# EasyEDA schematic SCH_robot_arm_2022-02-01.json
TITLE: Robot arm; REV: 1.0; Date: 2022-02-01; Sheet: 1/1; Drawn By: 07et842; Company: -
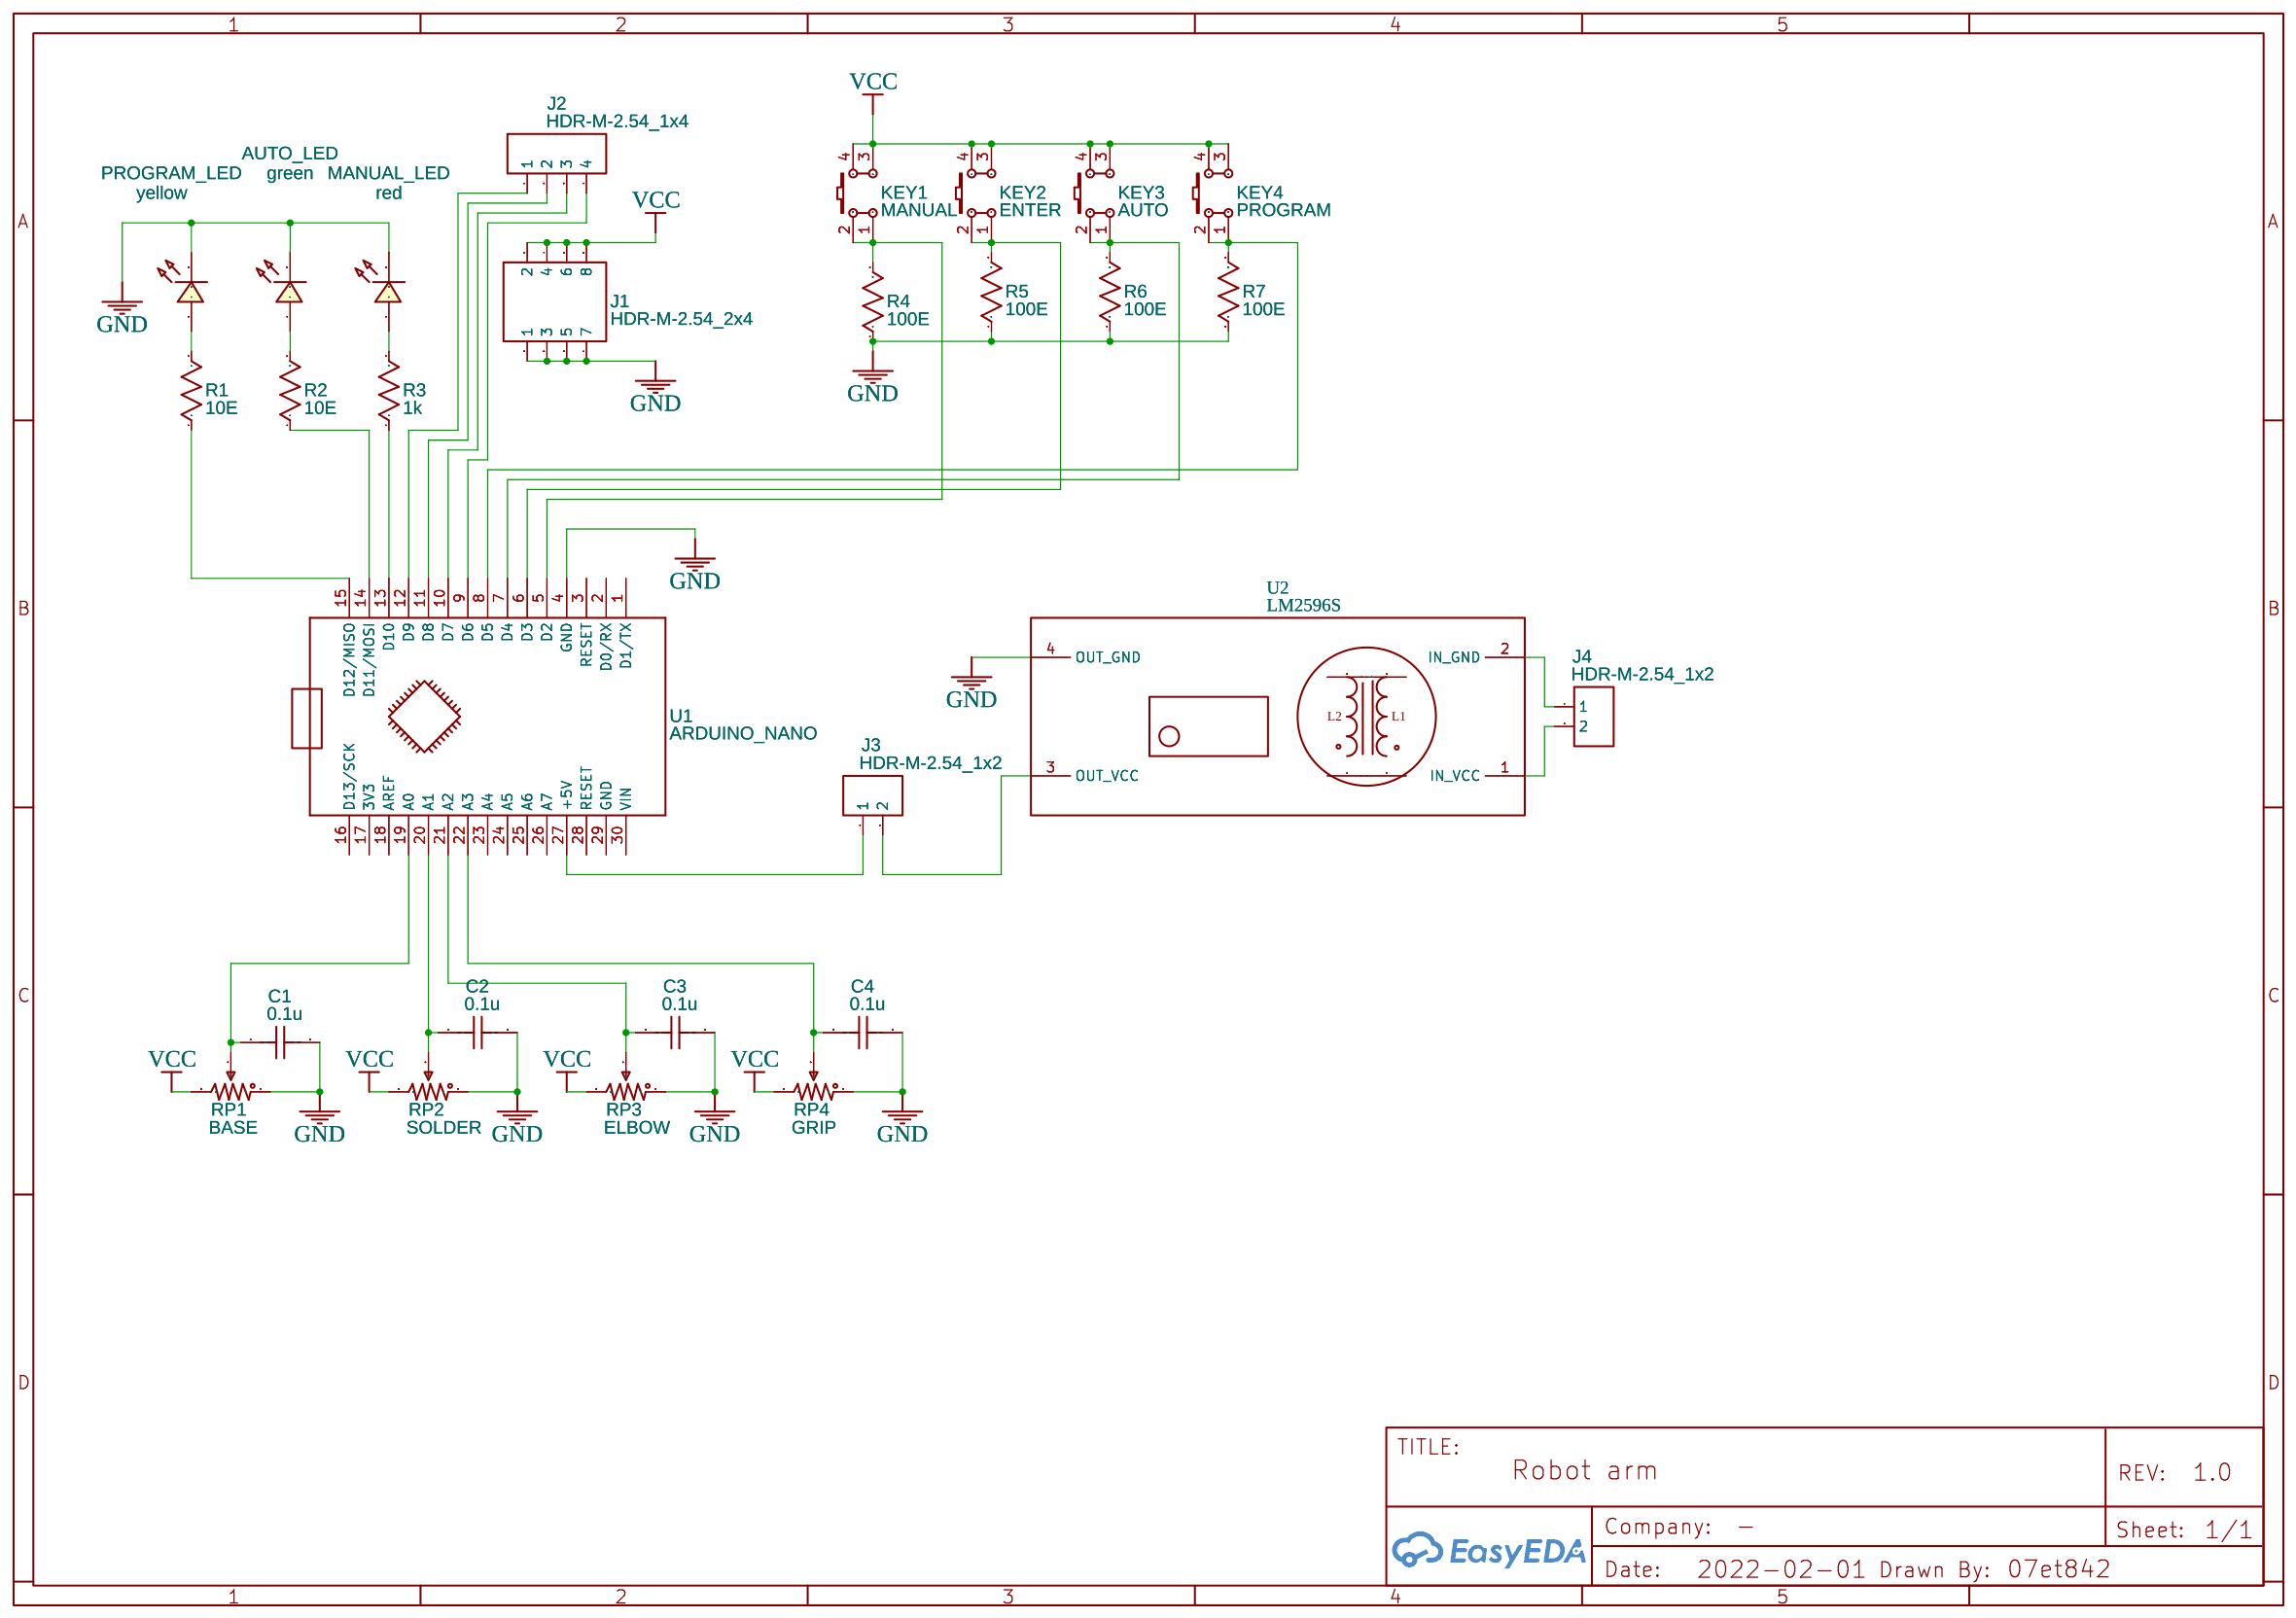
[diagram p0: schematic sheet]

## Parts
AUTO_LED  green  [LED0603_RED]
C1  0.1u  [C0603]
C2  0.1u  [C0603]
C3  0.1u  [C0603]
C4  0.1u  [C0603]
J1  HDR-M-2.54_2x4  [HDR-M-2.54_2X4]
J2  HDR-M-2.54_1x4  [HDR-M-2.54_1X4]
J3  HDR-M-2.54_1x2  [HDR-M-2.54_1X2]
J4  HDR-M-2.54_1x2  [HDR-M-2.54_1X2]
KEY1  MANUAL  [KEY-TH_4P-L6.0-W6.0-P4.50-LS6.5]
KEY2  ENTER  [KEY-TH_4P-L6.0-W6.0-P4.50-LS6.5]
KEY3  AUTO  [KEY-TH_4P-L6.0-W6.0-P4.50-LS6.5]
KEY4  PROGRAM  [KEY-TH_4P-L6.0-W6.0-P4.50-LS6.5]
MANUAL_LED  red  [LED0603_RED]
PROGRAM_LED  yellow  [LED0603_RED]
R1  10E  [R0603]
R2  10E  [R0603]
R3  1k  [R0603]
R4  100E  [R0603]
R5  100E  [R0603]
R6  100E  [R0603]
R7  100E  [R0603]
RP1  BASE  [RES-ADJ-TH_3386P]
RP2  SOLDER  [RES-ADJ-TH_3386P]
RP3  ELBOW  [RES-ADJ-TH_3386P]
RP4  GRIP  [RES-ADJ-TH_3386P]
U1  ARDUINO_NANO  [ARDUINO_NANO]
U2  LM2596S

## Library data of the parts
AUTO_LED MANUAL_LED PROGRAM_LED = LED-0603_R: Manufacturer: EVERLIGHT(台湾亿光); Manufacturer Part: 19-217/R6C-AL1M2VY/3T; Supplier Part: C72044; Supplier: LCSC; Contributor: LCEDA_01
C1-C4 = C_0603_US: Contributor: LCEDA_Lib
J1 = HDR-M-2.54_2x4: Supplier Part: C58363; Supplier: LCSC; Contributor: LCEDA_Lib
J2 = HDR-M-2.54_1x4: Supplier Part: C124378; Supplier: LCSC; Contributor: LCEDA_Lib
J3 J4 = HDR-M-2.54_1x2: Supplier Part: C124375; Supplier: LCSC; Contributor: LCEDA_Lib
KEY1-KEY4 = K4-6×6_TH: Supplier: LCSC; Supplier Part: C136684; Manufacturer: 韩国韩荣; Manufacturer Part: K2-1102DP-E4SW-04; Contributor: LCEDA_Lib
R1-R7 = R_0603_US: Contributor: LCEDA_Lib
RP1-RP4 = R_3386P_US: Supplier: LCSC; Contributor: LCEDA_Lib; value(Ω): 10K
U1 = -: sourceId: KGSeAWhDB; Manufacturer Part: ?

## Nets
GND: AUTO_LED.2 C1.2 C2.2 C3.2 C4.2 J1.1 J1.3 J1.5 J1.7 MANUAL_LED.2 PROGRAM_LED.2 R4.1 R5.1 R6.1 R7.1 RP1.1 RP2.1 RP3.1 RP4.1 U1.4(GND) U2.4(OUT_GND)
VCC: J1.2 J1.4 J1.6 J1.8 KEY1.3 KEY1.4 KEY2.3 KEY2.4 KEY3.3 KEY3.4 KEY4.3 KEY4.4 RP1.3 RP2.3 RP3.3 RP4.3
Net-(AUTO_LED-1): AUTO_LED.1 R2.2
Net-(C1-1): C1.1 RP1.2 U1.19(A0)
Net-(C2-1): C2.1 RP2.2 U1.20(A1)
Net-(C3-1): C3.1 RP3.2 U1.21(A2)
Net-(C4-1): C4.1 RP4.2 U1.22(A3)
Net-(J2-1): J2.1 U1.12(D9)
Net-(J2-2): J2.2 U1.11(D8)
Net-(J2-3): J2.3 U1.10(D7)
Net-(J2-4): J2.4 U1.9(D6)
Net-(J3-1): J3.1 U1.27(+5V)
Net-(J3-2): J3.2 U2.3(OUT_VCC)
Net-(J4-1): J4.1 U2.2(2 )
Net-(J4-2): J4.2 U2.1(1 )
Net-(KEY1-1): KEY1.1 KEY1.2 R4.2 U1.5(D2)
Net-(KEY2-1): KEY2.1 KEY2.2 R5.2 U1.6(D3)
Net-(KEY3-1): KEY3.1 KEY3.2 R6.2 U1.7(D4)
Net-(KEY4-1): KEY4.1 KEY4.2 R7.2 U1.8(D5)
Net-(MANUAL_LED-1): MANUAL_LED.1 R3.2
Net-(PROGRAM_LED-1): PROGRAM_LED.1 R1.2
Net-(R1-1): R1.1 U1.15(D12/MISO)
Net-(R2-1): R2.1 U1.14(D11/MOSI)
Net-(R3-1): R3.1 U1.13(D10)

Not connected (* = marked no-connect by the designer): U1 1(D1/TX) 2(D0/RX) 3(RESET) 16(D13/SCK) 17(3V3) 18(AREF) 23(A4) 24(A5) 25(A6) 26(A7) 28(RESET) 29(GND) 30(VIN)
